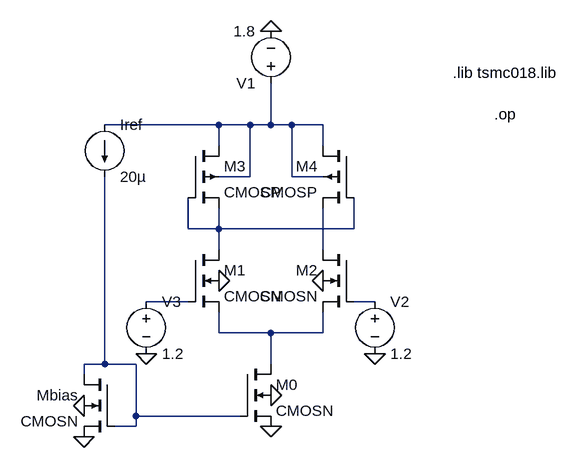
[diagram p0: schematic stage1_gui.asc]
stage1_gui.asc, the LTspice schematic file:
Version 4.1
SHEET 1 880 680
WIRE 96 -80 -80 -80
WIRE 144 -80 96 -80
WIRE 176 -80 176 -144
WIRE 176 -80 144 -80
WIRE 208 -80 176 -80
WIRE 256 -80 208 -80
WIRE 96 -48 96 -80
WIRE 256 -48 256 -80
WIRE 144 0 144 -80
WIRE 144 0 96 0
WIRE 208 0 208 -80
WIRE 256 0 208 0
WIRE 48 80 48 32
WIRE 96 80 96 48
WIRE 96 80 48 80
WIRE 304 80 304 32
WIRE 304 80 96 80
WIRE 96 112 96 80
WIRE 256 112 256 48
WIRE 48 192 -16 192
WIRE 336 192 304 192
WIRE 96 240 96 208
WIRE 176 240 96 240
WIRE 256 240 256 208
WIRE 256 240 176 240
WIRE -80 288 -80 0
WIRE -80 288 -112 288
WIRE -32 288 -80 288
WIRE 176 288 176 240
WIRE -112 304 -112 288
WIRE -32 368 -32 288
WIRE 128 368 -32 368
WIRE -32 384 -32 368
WIRE -32 384 -64 384
FLAG 176 -224 0
FLAG -112 352 0
FLAG 176 336 0
FLAG 96 160 0
FLAG 256 160 0
FLAG 336 272 0
FLAG -16 272 0
FLAG -112 400 0
FLAG 176 384 0
SYMBOL cmosn 48 112 R0
SYMATTR InstName M1
SYMATTR Value2 l=0.18u w=3.24u
SYMBOL cmosp 304 -48 M0
SYMATTR InstName M4
SYMATTR Value2 l=0.36u w=18u
SYMBOL cmosn 304 112 M0
SYMATTR InstName M2
SYMATTR Value2 l=0.18u w=3.24u
SYMBOL cmosp 48 -48 R0
SYMATTR InstName M3
SYMATTR Value2 l=0.36u w=18u
SYMBOL cmosn 128 288 R0
SYMATTR InstName M0
SYMATTR Value2 l=0.36u w=7.2u
SYMBOL cmosn -64 304 M0
SYMATTR InstName Mbias
SYMATTR Value2 l=0.36u w=1.44u
SYMBOL voltage 176 -128 R180
WINDOW 123 0 0 Left 0
WINDOW 39 0 0 Left 0
SYMATTR InstName V1
SYMATTR Value 1.8
SYMBOL voltage 336 176 R0
WINDOW 123 0 0 Left 0
WINDOW 39 0 0 Left 0
SYMATTR InstName V2
SYMATTR Value 1.2
SYMBOL voltage -16 176 R0
WINDOW 123 0 0 Left 0
WINDOW 39 0 0 Left 0
SYMATTR InstName V3
SYMATTR Value 1.2
SYMBOL current -80 -80 R0
WINDOW 123 0 0 Left 0
WINDOW 39 0 0 Left 0
SYMATTR InstName Iref
SYMATTR Value 20µ
TEXT 456 -160 Left 2 !.lib tsmc018.lib
TEXT 520 -96 Left 2 !.op

The netlist it stands for:
* stage1_gui.asc
M1 N002 N004 N006 0 CMOSN l=0.18u w=3.24u
M4 N001 N002 N003 N001 CMOSP l=0.36u w=18u
M2 N003 N005 N006 0 CMOSN l=0.18u w=3.24u
M3 N001 N002 N002 N001 CMOSP l=0.36u w=18u
M0 N006 N007 0 0 CMOSN l=0.36u w=7.2u
Mbias N007 N007 0 0 CMOSN l=0.36u w=1.44u
V1 N001 0 1.8
V2 N005 0 1.2
V3 N004 0 1.2
Iref N001 N007 20µ
.model NMOS NMOS
.model PMOS PMOS
.lib standard.mos
.lib tsmc018.lib
.op
.backanno
.end